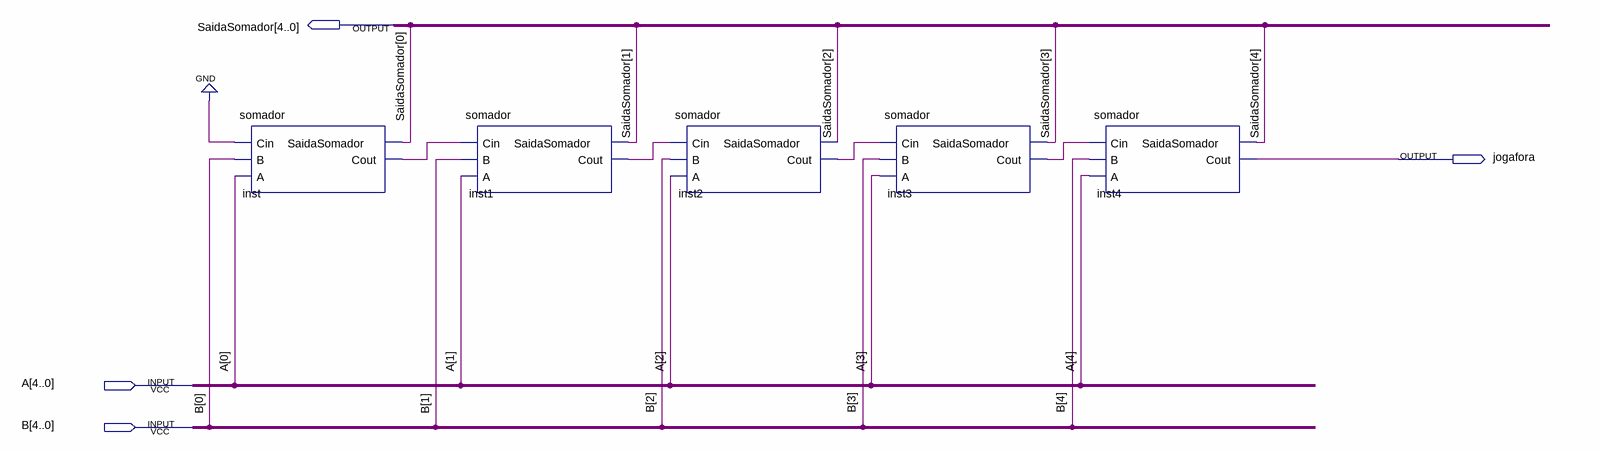
[diagram p0: schematic sheet]
// Quartus schematic somador_6_bits.bdf as structural Verilog: 5 symbols, 4 pins
module somador_6_bits (
  input  [4:0] A,
  input  [4:0] B,
  output [4:0] SaidaSomador,
  output jogafora
);

  wire inst1_cout, inst2_cout, inst3_cout, inst_cout;

  somador inst (.Cin(1'b0), .B(B[0]), .A(A[0]), .SaidaSomador(SaidaSomador[0]), .Cout(inst_cout));
  somador inst1 (.Cin(inst_cout), .B(B[1]), .A(A[1]), .SaidaSomador(SaidaSomador[1]), .Cout(inst1_cout));
  somador inst2 (.Cin(inst1_cout), .B(B[2]), .A(A[2]), .SaidaSomador(SaidaSomador[2]), .Cout(inst2_cout));
  somador inst3 (.Cin(inst2_cout), .B(B[3]), .A(A[3]), .SaidaSomador(SaidaSomador[3]), .Cout(inst3_cout));
  somador inst4 (.Cin(inst3_cout), .B(B[4]), .A(A[4]), .SaidaSomador(SaidaSomador[4]), .Cout(jogafora));
endmodule
